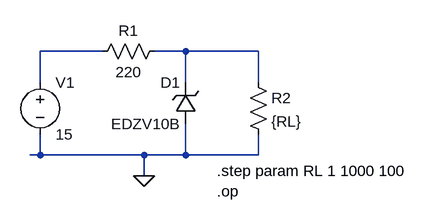
[diagram p0: schematic load_regulation eclab3.asc]
load_regulation eclab3.asc, the LTspice schematic file:
Version 4
SHEET 1 880 680
WIRE 144 64 48 64
WIRE 272 64 224 64
WIRE 384 64 272 64
WIRE 48 112 48 64
WIRE 272 112 272 64
WIRE 384 112 384 64
WIRE 48 224 48 192
WIRE 48 224 32 224
WIRE 208 224 48 224
WIRE 272 224 272 176
WIRE 272 224 208 224
WIRE 384 224 384 192
WIRE 384 224 272 224
WIRE 208 256 208 224
FLAG 208 256 0
SYMBOL voltage 48 96 R0
WINDOW 123 0 0 Left 0
WINDOW 39 0 0 Left 0
SYMATTR InstName V1
SYMATTR Value 15
SYMBOL res 240 48 R90
WINDOW 0 0 56 VBottom 2
WINDOW 3 32 56 VTop 2
SYMATTR InstName R1
SYMATTR Value 220
SYMBOL res 368 96 R0
SYMATTR InstName R2
SYMATTR Value {RL}
SYMBOL zener 288 176 R180
WINDOW 0 24 64 Left 2
WINDOW 3 24 0 Left 2
SYMATTR InstName D1
SYMATTR Value EDZV10B
SYMATTR Description Diode
SYMATTR Type diode
TEXT 320 248 Left 2 !.step param RL 1 1000 100
TEXT 320 280 Left 2 !.op

The netlist it stands for:
* load_regulation eclab3.asc
V1 N001 0 15
R1 N002 N001 220
R2 N002 0 {RL}
D1 0 N002 EDZV10B
.model D D
.lib standard.dio
.step param RL 1 1000 100
.op
.backanno
.end